# Altium schematic sheet Ethernet.SchDoc: Ethernet
size A3; Author: Orhun DABAK; DrawnBy: Orhun DABAK; Revision: 1.0; SheetNumber: 2; SheetTotal: 3
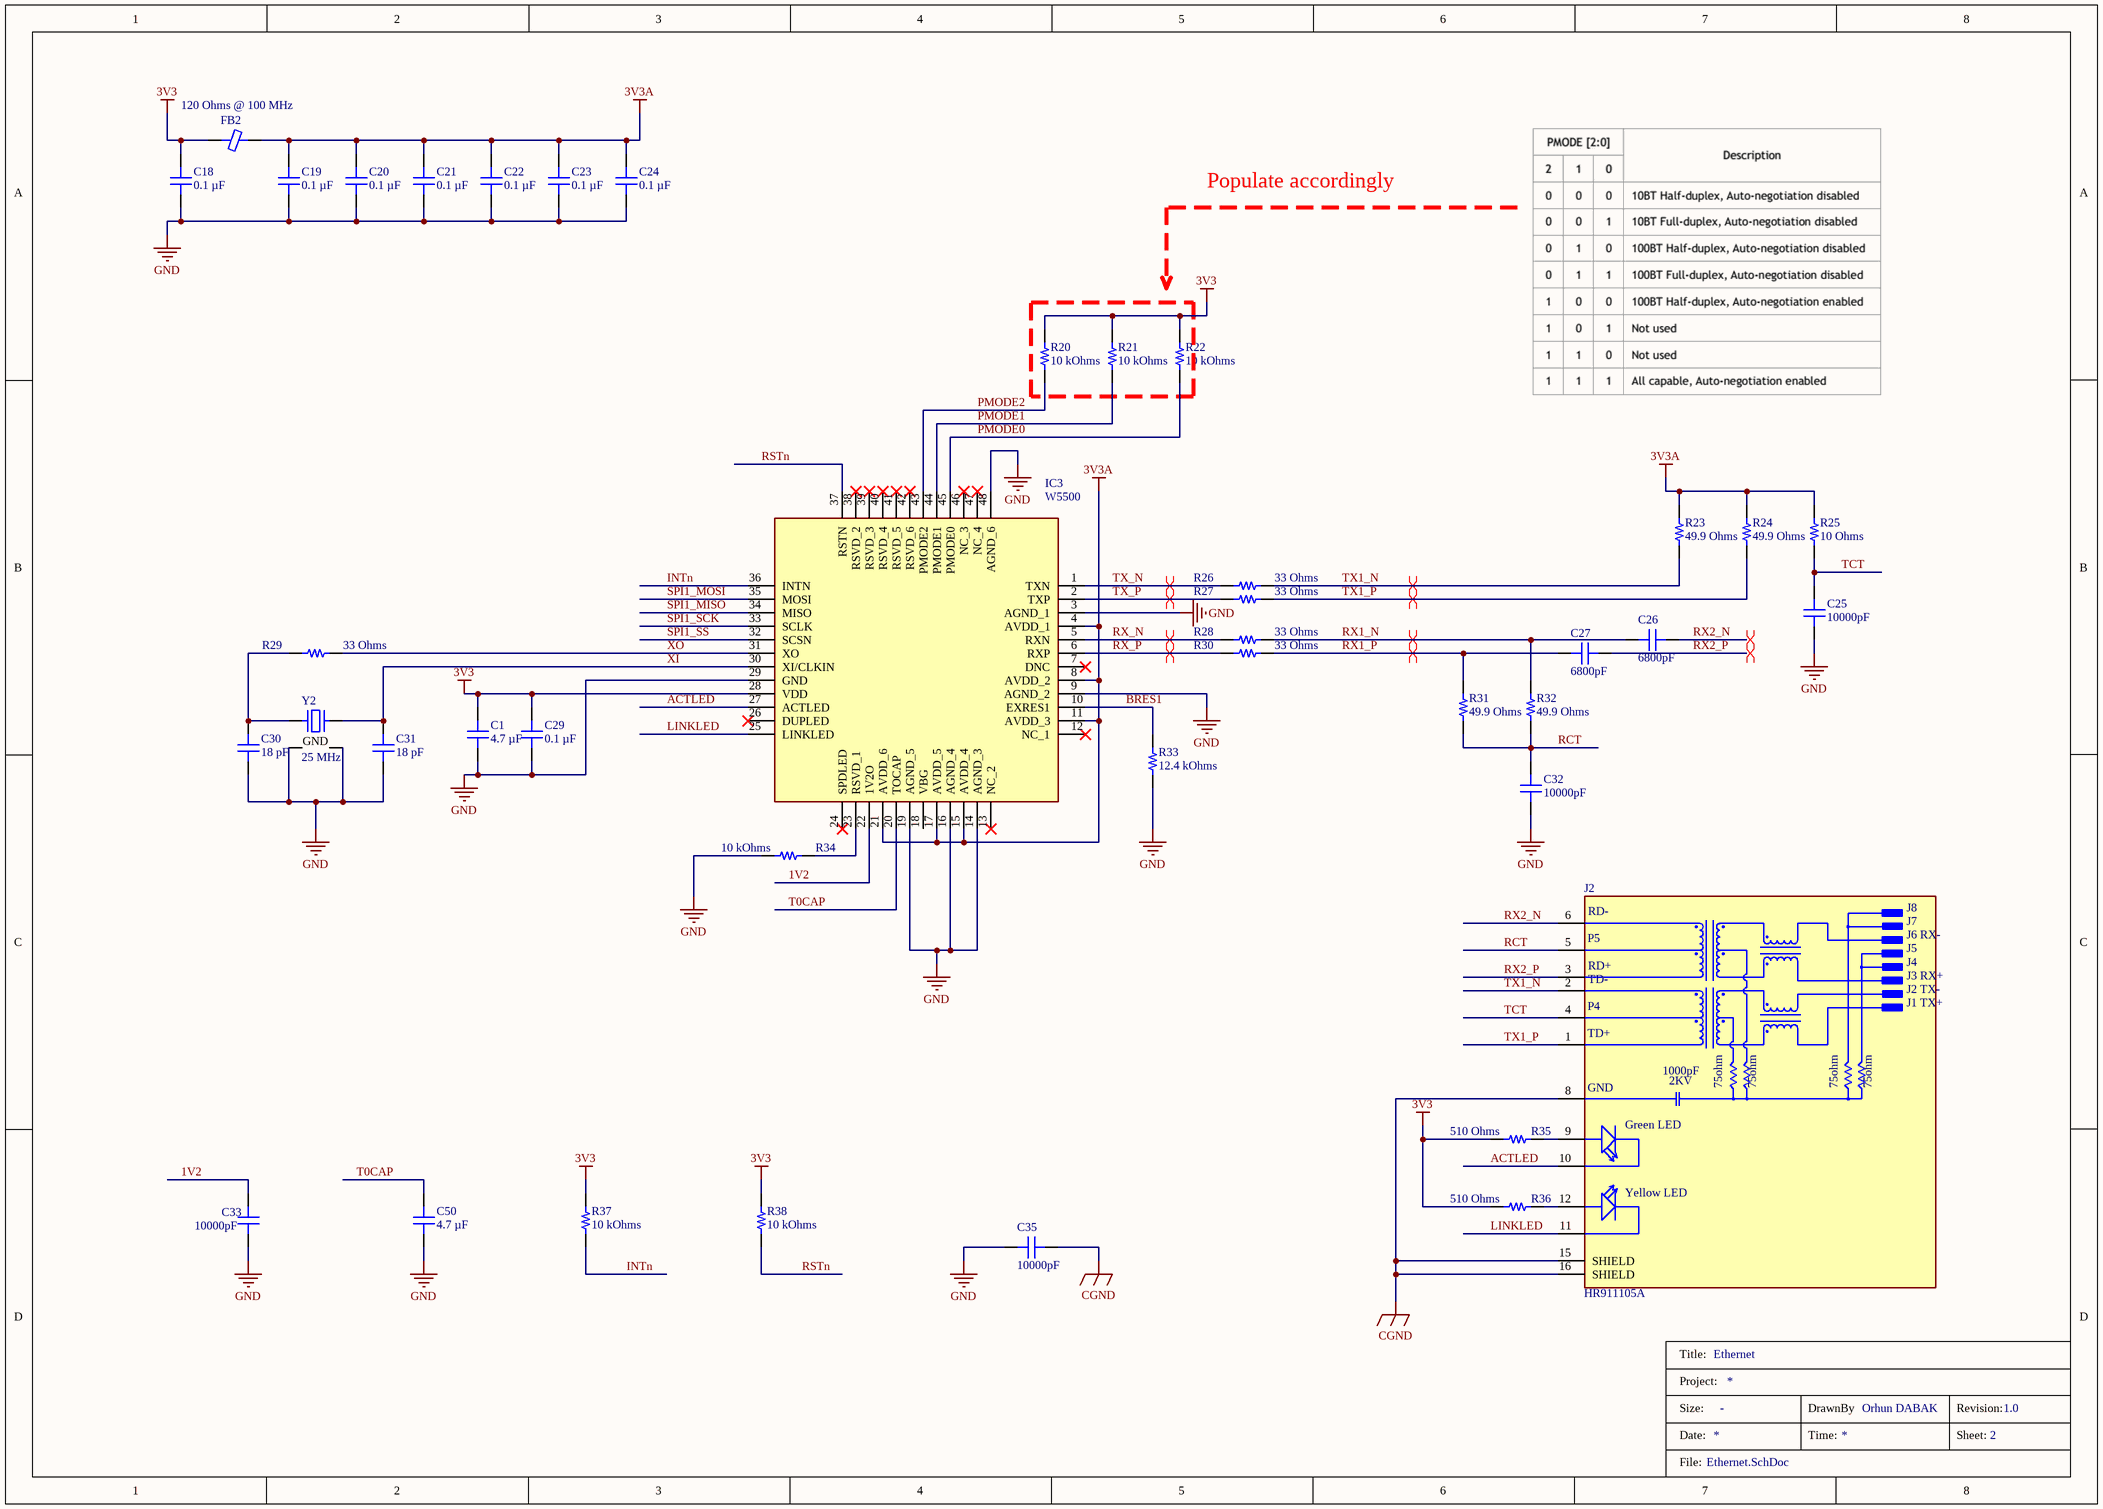
[diagram p0: Ethernet.SchDoc]

## Parts
*  Title_Block  (value not drawn)  (graphical)
C1  4.7 µF  [CAP 0603_1608]
C18  0.1 µF  [CAP 0603_1608]
C19  0.1 µF  [CAP 0603_1608]
C20  0.1 µF  [CAP 0603_1608]
C21  0.1 µF  [CAP 0603_1608]
C22  0.1 µF  [CAP 0603_1608]
C23  0.1 µF  [CAP 0603_1608]
C24  0.1 µF  [CAP 0603_1608]
C25  10000pF  [CAP 0603_1608]
C26  6800pF  [CAP 0603_1608]
C27  6800pF  [CAP 0603_1608]
C29  0.1 µF  [CAP 0603_1608]
C30  18 pF  [CAP 0603_1608]
C31  18 pF  [CAP 0603_1608]
C32  10000pF  [CAP 0603_1608]
C33  10000pF  [CAP 0603_1608]
C35  10000pF  [CAP 0603_1608]
C50  4.7 µF  [CAP 0603_1608]
FB2  120 Ohms @ 100 MHz  [FER 0603_1608]
IC3  W5500  [QFP50P900X900X160-48N]
J2  HR911105A  [HANRUN_HR911105A]
R20  10 kOhms  [RES 0603_1608]
R21  10 kOhms  [RES 0603_1608]
R22  10 kOhms  [RES 0603_1608]
R23  49.9 Ohms  [RES 0603_1608]
R24  49.9 Ohms  [RES 0603_1608]
R25  10 Ohms  [RES 0603_1608]
R26  33 Ohms  [RES 0603_1608]
R27  33 Ohms  [RES 0603_1608]
R28  33 Ohms  [RES 0603_1608]
R29  33 Ohms  [RES 0603_1608]
R30  33 Ohms  [RES 0603_1608]
R31  49.9 Ohms  [RES 0603_1608]
R32  49.9 Ohms  [RES 0603_1608]
R33  12.4 kOhms  [RES 0603_1608]
R34  10 kOhms  [RES 0603_1608]
R35  510 Ohms  [RES 0603_1608]
R36  510 Ohms  [RES 0603_1608]
R37  10 kOhms  [RES 0603_1608]
R38  10 kOhms  [RES 0603_1608]
Y2  25 MHz  [EPSON TSX-3225]

## Nets
3V3: C1.2 C18.1 C29.1 FB2.1 IC3.28(VDD) R20.2 R21.2 R22.2 R35.2 R36.2 R37.1 R38.2
3V3A: C19.1 C20.1 C21.1 C22.1 C23.1 C24.1 FB2.2 IC3.4(AVDD_1) IC3.8(AVDD_2) IC3.11(AVDD_3) IC3.15(AVDD_4) IC3.17(AVDD_5) IC3.21(AVDD_6) R23.2 R24.2 R25.2
CGND: C35.1 J2.8(GND) J2.15(SHIELD) J2.16(SHIELD)
GND: C1.1 C18.2 C19.2 C20.2 C21.2 C22.2 C23.2 C24.2 C25.1 C29.2 C30.1 C31.1 C32.1 C33.1 C35.2 C50.1 IC3.3(AGND_1) IC3.9(AGND_2) IC3.14(AGND_3) IC3.16(AGND_4) IC3.19(AGND_5) IC3.29(GND) IC3.48(AGND_6) R33.1 R34.2 Y2.2(GND) Y2.4(GND)
1V2: C33.2 IC3.22(1V2O)
ACTLED: IC3.27(ACTLED) J2.10(GC)
BRES1: IC3.10(EXRES1) R33.2
INTn: IC3.36(INTN) R37.2
LINKLED: IC3.25(LINKLED) J2.11(YC)
PMODE0: IC3.45(PMODE0) R22.1
PMODE1: IC3.44(PMODE1) R21.1
PMODE2: IC3.43(PMODE2) R20.1
RCT: C32.2 J2.5(P5) R31.1 R32.1
RSTn: IC3.37(RSTN) R38.1
RX1_N: C26.1 R28.2 R32.2
RX1_P: C27.1 R30.2 R31.2
RX2_N: C26.2 J2.6(RD-)
RX2_P: C27.2 J2.3(RD+)
RX_N: IC3.5(RXN) R28.1
RX_P: IC3.6(RXP) R30.1
SPI1_MISO: IC3.34(MISO)
SPI1_MOSI: IC3.35(MOSI)
SPI1_SCK: IC3.33(SCLK)
SPI1_SS: IC3.32(SCSN)
T0CAP: C50.2 IC3.20(TOCAP)
TCT: C25.2 J2.4(P4) R25.1
TX1_N: J2.2(TD-) R23.1 R26.2
TX1_P: J2.1(TD+) R24.1 R27.2
TX_N: IC3.1(TXN) R26.1
TX_P: IC3.2(TXP) R27.1
XI: C31.2 IC3.30(XI/CLKIN) Y2.3
XO: IC3.31(XO) R29.2
NetC30_2: C30.2 R29.1 Y2.1
NetIC3_23: IC3.23(RSVD_1) R34.1
NetJ2_9: J2.9(GA) R35.1
NetJ2_12: J2.12(YA) R36.1

Not connected (* = marked no-connect by the designer): IC3 7(DNC)* 12(NC_1)* 13(NC_2)* 18(VBG) 24(SPDLED)* 26(DUPLED)* 38(RSVD_2)* 39(RSVD_3)* 40(RSVD_4)* 41(RSVD_5)* 42(RSVD_6)* 46(NC_3)* 47(NC_4)*

## Layout directives
differential pair: RX1_N, RX1_P, RX2_N, RX2_P, RX_N, RX_P, TX1_N, TX1_P, TX_N, TX_P

## Notes on the sheet
- Populate accordingly
- (in symbol HR911105A) J8; J7; J6 RX-; J5; J4; J3 RX+; J2 TX-; J1 TX+; 1000pF; 2KV; 75ohm; Green LED; Yellow LED
- (in symbol Title_Block) Title:; Project:; Size:; DrawnBy; Revision:; Date:; Time:; Sheet:; File:

## Library data of the parts
* = Title_Block: Standart Title Block; Size: -
C1 C50 = GRT188C81C475ME13D: CAP CER 4.7UF 16V X6S 0603; manufacturer: Murata Electronics; Tolerance: ±20%; Part Number: GRT188C81C475ME13D; Value: 4.7 µF; Applications: Automotive; Capacitance: 4.7 µF; componentlink1description: Datasheet; componentlink1url: https://search.murata.co.jp/Ceramy/image/img/A01X/G101/ENG/GRT188C81C475ME13-01.pdf; componentlink2description: DigiKey Link; componentlink2url: https://www.digikey.com/en/products/detail/murata-electronics/GRT188C81C475ME13D/5416712; Device Package: 0603 (1608 Metric); lastupdated: 3/3/2023 08:08:51 PM; Lifecycle Status: Active; Minimum Order: 1; Mounting Type: Surface Mount, MLCC; Operating Temperature: -55°C ~ 105°C; Package / Case: 0603 (1608 Metric); packaging: TapeAndReel; partid: 2551; Part Status: Active; price: 0.02; Ratings: AEC-Q200; series: GRT; Size / Dimension: 0.063" L x 0.031" W (1.60mm x 0.80mm); Supplier 1: DigiKey; Supplier Part Number 1: 490-12290-1-ND; Temperature Coefficient: X6S; Thickness (Max): 0.035" (0.90mm); Voltage - Rated: 16V
C18-C24 C29 = CS0603KRX7R7BB104: CAP CER 0.1UF 16V X7R 0603; manufacturer: Yageo; Tolerance: ±10%; Part Number: CS0603KRX7R7BB104; Value: 0.1 µF; Applications: Boardflex Sensitive; Capacitance: 0.1 µF; componentlink1description: Datasheet; componentlink1url: http://www.yageo.com/NewPortal/yageodocoutput?fileName=/pdf/MLCC/UPY-ST_NPOX7R_16V-to-3KV_5.pdf; componentlink2description: DigiKey Link; componentlink2url: https://www.digikey.com/en/products/detail/yageo/CS0603KRX7R7BB104/6097897; Device Package: 0603 (1608 Metric); Features: Soft Termination; lastupdated: 3/3/2023 08:08:52 PM; Lifecycle Status: Active; Minimum Order: 1; Mounting Type: Surface Mount, MLCC; Operating Temperature: -55°C ~ 125°C; Package / Case: 0603 (1608 Metric); packaging: TapeAndReel; partid: 2286; Part Status: Active; price: 0.01; series: CS; Size / Dimension: 0.063" L x 0.031" W (1.60mm x 0.80mm); Supplier 1: DigiKey; Supplier Part Number 1: 311-3560-1-ND; Temperature Coefficient: X7R; Thickness (Max): 0.037" (0.95mm); Voltage - Rated: 16V
C25 C32 C33 C35 = 0603YC103JAT2A: CAP CER 10000PF 16V X7R 0603; manufacturer: AVX Corporation; Tolerance: ±5%; Part Number: 0603YC103JAT2A; Value: 10000pF; Applications: General Purpose; Capacitance: 10000pF; componentlink1description: Datasheet; componentlink1url: http://datasheets.avx.com/X7RDielectric.pdf; componentlink2description: DigiKey Link; componentlink2url: http://digikey.com/product-detail/en/avx-corporation/0603YC103JAT2A/478-6208-1-ND/2391407; Device Package: 0603 (1608 Metric); lastupdated: 9/2/2020 01:03:35 AM; Lifecycle Status: Active; Minimum Order: 1; Mounting Type: Surface Mount, MLCC; Operating Temperature: -55°C ~ 125°C; Package / Case: 0603 (1608 Metric); packaging: TapeAndReel; partid: 2747; Part Status: Active; price: 0.02; series: -; Size / Dimension: 0.063" L x 0.032" W (1.60mm x 0.81mm); Supplier 1: DigiKey; Supplier Part Number 1: 478-6208-1-ND; Temperature Coefficient: X7R; Thickness (Max): 0.035" (0.90mm); Voltage - Rated: 16V
C26 C27 = 06035C682KAT2A: CAP CER 6800PF 50V X7R 0603; manufacturer: AVX Corporation; Tolerance: ±10%; Part Number: 06035C682KAT2A; Value: 6800pF; Applications: General Purpose; Capacitance: 6800pF; componentlink1description: Datasheet; componentlink1url: http://datasheets.avx.com/X7RDielectric.pdf; componentlink2description: DigiKey Link; componentlink2url: http://digikey.com/product-detail/en/avx-corporation/06035C682KAT2A/478-1225-1-ND/564257; Device Package: 0603 (1608 Metric); lastupdated: 9/2/2020 01:03:35 AM; Lifecycle Status: Active; Minimum Order: 1; Mounting Type: Surface Mount, MLCC; Operating Temperature: -55°C ~ 125°C; Package / Case: 0603 (1608 Metric); packaging: TapeAndReel; partid: 2828; Part Status: Active; price: 0.02; series: -; Size / Dimension: 0.063" L x 0.032" W (1.60mm x 0.81mm); Supplier 1: DigiKey; Supplier Part Number 1: 478-1225-1-ND; Temperature Coefficient: X7R; Thickness (Max): 0.035" (0.90mm); Voltage - Rated: 50V
C30 C31 = VJ0603A180JXACW1BC: CAP CER 18PF 50V C0G/NP0 0603; manufacturer: Vishay Vitramon; Temperature Coefficient: C0G, NP0; Tolerance: ±5%; Part Number: VJ0603A180JXACW1BC; Value: 18 pF; Applications: General Purpose; Capacitance: 18 pF; componentlink1description: Datasheet; componentlink1url: https://www.vishay.com/docs/28548/vjw1bcbascomseries.pdf; componentlink2description: DigiKey Link; componentlink2url: https://www.digikey.com/en/products/detail/vishay-vitramon/VJ0603A180JXACW1BC/420843; Device Package: 0603 (1608 Metric); lastupdated: 3/3/2023 08:08:47 PM; Lifecycle Status: Active; Minimum Order: 1; Mounting Type: Surface Mount, MLCC; Operating Temperature: -55°C ~ 125°C; Package / Case: 0603 (1608 Metric); packaging: TapeAndReel; partid: 4200; Part Status: Active; price: 0.01; series: VJ W1BC; Size / Dimension: 0.063" L x 0.031" W (1.60mm x 0.80mm); Supplier 1: DigiKey; Supplier Part Number 1: 720-1524-1-ND; Thickness (Max): 0.035" (0.90mm); Voltage - Rated: 50V
FB2 = 742792625: FERRITE BEAD 120 OHM 0603 1LN; Manufacturer: Würth Elektronik; Current Rating (Max): 2A; DC Resistance (DCR) (Max): 50mOhm; Filter Type: Signal Line; Number of Lines: 1; Part Number: 742792625; ComponentLink1Description: Datasheet; ComponentLink1URL: https://katalog.we-online.de/pbs/datasheet/742792625.pdf; ComponentLink2Description: DigiKey Link; ComponentLink2URL: https://www.digikey.com/en/products/detail/würth-elektronik/742792625/4310426; Device Package: 0603 (1608 Metric); Height (Max): 0.039" (1.00mm); Impedance @ Frequency: 120 Ohms @ 100 MHz; LastUpdated: 3/3/2023 08:50:24 PM; Lifecycle Status: Active; Minimum Order: 1; Mounting Type: Surface Mount; Operating Temperature: -55°C ~ 125°C; Package / Case: 0603 (1608 Metric); Packaging: TapeAndReel; PartId: 1102; Part Status: Active; Price: 0.10; Ratings: AEC-Q200; Series: WE-CBF; Size / Dimension: 0.063" L x 0.032" W (1.60mm x 0.80mm); Supplier 1: DigiKey; Supplier Part Number 1: 732-4665-1-ND; Value: 120 Ohms @ 100 MHz
IC3 = W5500: Integrated Circuit; Manufacturer_Name: WIZnet Inc; Datasheet Link: http://wizwiki.net/wiki/lib/exe/fetch.php?media=products:w5500:w5500_ds_v106e_141230.pdf; Height: 1.6mm; Manufacturer_Part_Number: W5500; Mouser Part Number: 950-W5500; Mouser Price/Stock: https://www.mouser.co.uk/ProductDetail/WIZnet/W5500?qs=2vh%252B45pPFtzthUpYPd4pqA%3D%3D
J2 = HR911105A: DIP RJ45 Connector;; Package: None; MP: HR911105A; Value: *; Price: None; Availability: Unavailable
R20-R22 R34 R37 R38 = CRCW060310K0JNEA: RES SMD 10K OHM 5% 1/10W 0603; Manufacturer: Vishay Dale; Power (Watts): 0.1W, 1/10W; Temperature Coefficient: ±200ppm/°C; Part Number: CRCW060310K0JNEA; Value: 10 kOhms; ComponentLink1Description: Datasheet; ComponentLink1URL: http://www.vishay.com/docs/20035/dcrcwe3.pdf; ComponentLink2Description: DigiKey Link; ComponentLink2URL: http://digikey.com/product-detail/en/vishay-dale/CRCW060310K0JNEA/541-10KGCT-ND/1179393; Composition: Thick Film; Device Package: 0603 (1608 Metric); Features: Automotive AEC-Q200; Height - Seated (Max): 0.020" (0.50mm); LastUpdated: 3/3/2023 08:29:48 PM; Lifecycle Status: Active; Minimum Order: 1; Number of Terminations: 2; Operating Temperature: -55°C ~ 155°C; Package / Case: 0603 (1608 Metric); Packaging: CutTape; PartId: 5216; Part Status: Active; Price: 0.10; Ratings: AEC-Q200; Resistance: 10 kOhms; Series: CRCW; Size / Dimension: 0.063" L x 0.033" W (1.60mm x 0.85mm); Supplier 1: DigiKey; Supplier Part Number 1: 541-10KGCT-ND; Supplier Device Package: 0603; Tolerance: ±5%
R23 R24 R31 R32 = ERJ-3EKF49R9V: RES SMD 49.9 OHM 1% 1/10W 0603; Manufacturer: Panasonic Electronic Components; Power (Watts): 0.1W, 1/10W; Temperature Coefficient: ±100ppm/°C; Part Number: ERJ-3EKF49R9V; Value: 49.9 Ohms; ComponentLink1Description: Datasheet; ComponentLink1URL: https://industrial.panasonic.com/cdbs/www-data/pdf/RDA0000/AOA0000C304.pdf; ComponentLink2Description: DigiKey Link; ComponentLink2URL: https://www.digikey.com/en/products/detail/panasonic-electronic-components/ERJ-3EKF49R9V/196378; Composition: Thick Film; Device Package: 0603 (1608 Metric); Features: Automotive AEC-Q200; Height - Seated (Max): 0.022" (0.55mm); LastUpdated: 3/3/2023 08:29:47 PM; Lifecycle Status: Active; Minimum Order: 1; Number of Terminations: 2; Operating Temperature: -55°C ~ 155°C; Package / Case: 0603 (1608 Metric); Packaging: TapeAndReel; PartId: 5641; Part Status: Active; Price: 0.01; Ratings: AEC-Q200; Resistance: 49.9 Ohms; Series: ERJ-3EK; Size / Dimension: 0.063" L x 0.031" W (1.60mm x 0.80mm); Supplier 1: DigiKey; Supplier Part Number 1: P49.9HCT-ND; Supplier Device Package: 0603; Tolerance: ±1%
R25 = ERJ-3EKF10R0V: RES SMD 10 OHM 1% 1/10W 0603; Manufacturer: Panasonic Electronic Components; Power (Watts): 0.1W, 1/10W; Temperature Coefficient: ±100ppm/°C; Part Number: ERJ-3EKF10R0V; Value: 10 Ohms; ComponentLink1Description: Datasheet; ComponentLink1URL: https://industrial.panasonic.com/cdbs/www-data/pdf/RDA0000/AOA0000C304.pdf; ComponentLink2Description: DigiKey Link; ComponentLink2URL: https://www.digikey.com/en/products/detail/panasonic-electronic-components/ERJ-3EKF10R0V/196065; Composition: Thick Film; Device Package: 0603 (1608 Metric); Features: Automotive AEC-Q200; Height - Seated (Max): 0.022" (0.55mm); LastUpdated: 3/3/2023 08:29:47 PM; Lifecycle Status: Active; Minimum Order: 1; Number of Terminations: 2; Operating Temperature: -55°C ~ 155°C; Package / Case: 0603 (1608 Metric); Packaging: TapeAndReel; PartId: 5647; Part Status: Active; Price: 0.01; Ratings: AEC-Q200; Resistance: 10 Ohms; Series: ERJ-3EK; Size / Dimension: 0.063" L x 0.031" W (1.60mm x 0.80mm); Supplier 1: DigiKey; Supplier Part Number 1: P10.0HCT-ND; Supplier Device Package: 0603; Tolerance: ±1%
R26-R30 = RMCF0603JT33R0: RES 33 OHM 5% 1/10W 0603; Manufacturer: Stackpole Electronics Inc; Power (Watts): 0.1W, 1/10W; Temperature Coefficient: ±200ppm/°C; Part Number: RMCF0603JT33R0; Value: 33 Ohms; ComponentLink1Description: Datasheet; ComponentLink1URL: https://www.seielect.com/catalog/sei-rmcf_rmcp.pdf; ComponentLink2Description: DigiKey Link; ComponentLink2URL: https://www.digikey.com/en/products/detail/stackpole-electronics-inc/RMCF0603JT33R0/1758048; Composition: Thick Film; Device Package: 0603 (1608 Metric); Features: Automotive AEC-Q200; Height - Seated (Max): 0.022" (0.55mm); LastUpdated: 3/3/2023 08:29:46 PM; Lifecycle Status: Active; Minimum Order: 1; Number of Terminations: 2; Operating Temperature: -55°C ~ 155°C; Package / Case: 0603 (1608 Metric); Packaging: CutTape; PartId: 5849; Part Status: Active; Price: 0.01; Ratings: AEC-Q200; Resistance: 33 Ohms; Series: RMCF; Size / Dimension: 0.061" L x 0.031" W (1.55mm x 0.80mm); Supplier 1: DigiKey; Supplier Part Number 1: RMCF0603JT33R0CT-ND; Supplier Device Package: 0603; Tolerance: ±5%
R33 = RNCP0603FTD12K4: RES 12.4K OHM 1% 1/8W 0603; Manufacturer: Stackpole Electronics Inc; Power (Watts): 0.125W, 1/8W; Temperature Coefficient: ±100ppm/°C; Part Number: RNCP0603FTD12K4; Value: 12.4 kOhms; ComponentLink1Description: Datasheet; ComponentLink1URL: https://www.seielect.com/catalog/sei-rncp.pdf; ComponentLink2Description: DigiKey Link; ComponentLink2URL: https://www.digikey.com/en/products/detail/stackpole-electronics-inc/RNCP0603FTD12K4/2240143; Composition: Thin Film; Device Package: 0603 (1608 Metric); Features: Anti-Sulfur; Height - Seated (Max): 0.022" (0.55mm); LastUpdated: 3/3/2023 08:29:47 PM; Lifecycle Status: Active; Minimum Order: 1; Number of Terminations: 2; Operating Temperature: -55°C ~ 155°C; Package / Case: 0603 (1608 Metric); Packaging: TapeAndReel; PartId: 5715; Part Status: Active; Price: 0.01; Resistance: 12.4 kOhms; Series: RNCP; Size / Dimension: 0.061" L x 0.031" W (1.55mm x 0.80mm); Supplier 1: DigiKey; Supplier Part Number 1: RNCP0603FTD12K4CT-ND; Supplier Device Package: 0603; Tolerance: ±1%
R35 R36 = RMCF0603JT510R: RES 510 OHM 5% 1/10W 0603; Manufacturer: Stackpole Electronics Inc; Power (Watts): 0.1W, 1/10W; Temperature Coefficient: ±200ppm/°C; Part Number: RMCF0603JT510R; Value: 510 Ohms; ComponentLink1Description: Datasheet; ComponentLink1URL: https://www.seielect.com/catalog/sei-rmcf_rmcp.pdf; ComponentLink2Description: DigiKey Link; ComponentLink2URL: https://www.digikey.com/en/products/detail/stackpole-electronics-inc/RMCF0603JT510R/1757941; Composition: Thick Film; Device Package: 0603 (1608 Metric); Features: Automotive AEC-Q200; Height - Seated (Max): 0.022" (0.55mm); LastUpdated: 3/3/2023 08:29:46 PM; Lifecycle Status: Active; Minimum Order: 1; Number of Terminations: 2; Operating Temperature: -55°C ~ 155°C; Package / Case: 0603 (1608 Metric); Packaging: CutTape; PartId: 5929; Part Status: Active; Price: 0.01; Ratings: AEC-Q200; Resistance: 510 Ohms; Series: RMCF; Size / Dimension: 0.061" L x 0.031" W (1.55mm x 0.80mm); Supplier 1: DigiKey; Supplier Part Number 1: RMCF0603JT510RCT-ND; Supplier Device Package: 0603; Tolerance: ±5%
Y2 = TSX-3225 25.0000MF10P-C0: CRYSTAL 25.0000MHZ 18PF SMD; Manufacturer: EPSON; ESR (Equivalent Series Resistance): 40 Ohms; Frequency Stability: ±10ppm; Operating Mode: Fundamental; Part Number: TSX-3225 25.0000MF10P-C0; ComponentLink1Description: Datasheet; ComponentLink1URL: https://support.epson.biz/td/api/doc_check.php?dl=brief_TSX-3225&lang=en; ComponentLink2Description: DigiKey Link; ComponentLink2URL: https://www.digikey.com/en/products/detail/epson/TSX-3225-25-0000MF10P-C0/7430946; Frequency: 25 MHz; Frequency Tolerance: ±10ppm; Height - Seated (Max): 0.024" (0.60mm); LastUpdated: 3/3/2023 08:58:01 PM; Lifecycle Status: Active; Load Capacitance: 18pF; Minimum Order: 1; Mounting Type: Surface Mount; Operating Temperature: -20°C ~ 85°C; Package / Case: 4-SMD, No Lead; Packaging: TapeAndReel; PartId: 450; Part Status: Active; Price: 0.20; Series: TSX-3225; Size / Dimension: 0.126" L x 0.098" W (3.20mm x 2.50mm); Supplier 1: DigiKey; Supplier Part Number 1: SER4211CT-ND; Type: MHz Crystal; Value: 25 MHz